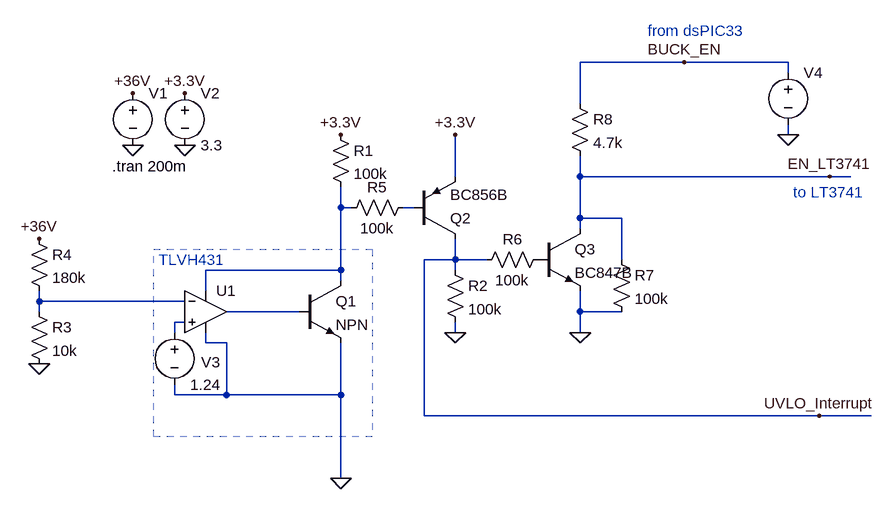
[diagram p0: schematic uvlo.asc]
uvlo.asc, the LTspice schematic file:
Version 4
SHEET 1 1320 680
WIRE 704 -112 544 -112
WIRE 864 -112 704 -112
WIRE 864 -96 864 -112
WIRE 544 -48 544 -112
WIRE 864 0 864 -16
WIRE 352 64 352 0
WIRE 544 64 544 32
WIRE 928 64 544 64
WIRE 960 64 928 64
WIRE 176 112 176 80
WIRE 192 112 176 112
WIRE 288 112 272 112
WIRE 544 128 544 64
WIRE 608 128 544 128
WIRE 544 144 544 128
WIRE 352 192 352 160
WIRE 352 192 304 192
WIRE 400 192 352 192
WIRE 608 192 608 128
WIRE 176 208 176 112
WIRE 176 208 -32 208
WIRE 352 208 352 192
WIRE 176 224 176 208
WIRE -32 240 -32 208
WIRE -288 256 -288 240
WIRE -64 256 -288 256
WIRE -288 272 -288 256
WIRE 112 272 0 272
WIRE 544 272 544 240
WIRE 608 272 544 272
WIRE -64 288 -80 288
WIRE -80 304 -80 288
WIRE 352 304 352 288
WIRE 544 304 544 272
WIRE -32 320 -32 304
WIRE 0 320 -32 320
WIRE -80 400 -80 384
WIRE 0 400 0 320
WIRE 0 400 -80 400
WIRE 176 400 176 320
WIRE 176 400 0 400
WIRE 304 432 304 192
WIRE 912 432 304 432
WIRE 992 432 912 432
WIRE 176 528 176 400
FLAG -144 16 0
FLAG -64 16 0
FLAG -144 -64 +36V
FLAG -64 -64 +3.3V
FLAG -288 352 0
FLAG -288 160 +36V
FLAG 176 528 0
FLAG 928 64 EN_LT3741
FLAG 176 0 +3.3V
FLAG 352 0 +3.3V
FLAG 352 304 0
FLAG 544 304 0
FLAG 864 0 0
FLAG 704 -112 BUCK_EN
FLAG 912 432 UVLO_Interrupt
SYMBOL voltage -144 -80 R0
WINDOW 3 24 96 Invisible 2
WINDOW 123 0 0 Left 2
WINDOW 39 0 0 Left 2
SYMATTR Value PULSE(36 0 0 100m)
SYMATTR InstName V1
SYMBOL voltage -64 -80 R0
WINDOW 123 0 0 Left 2
WINDOW 39 0 0 Left 2
SYMATTR InstName V2
SYMATTR Value 3.3
SYMBOL Opamps\\UniversalOpamp2 -32 272 R0
SYMATTR InstName U1
SYMBOL npn 112 224 R0
SYMATTR InstName Q1
SYMBOL voltage -80 288 R0
WINDOW 0 41 62 Left 2
WINDOW 123 0 0 Left 2
WINDOW 39 0 0 Left 2
SYMATTR InstName V3
SYMATTR Value 1.24
SYMBOL res -304 256 R0
SYMATTR InstName R3
SYMATTR Value 10k
SYMBOL res -304 144 R0
SYMATTR InstName R4
SYMATTR Value 180k
SYMBOL res 160 -16 R0
SYMATTR InstName R1
SYMATTR Value 100k
SYMBOL pnp 288 160 M180
SYMATTR InstName Q2
SYMATTR Value BC856B
SYMBOL res 336 192 R0
SYMATTR InstName R2
SYMATTR Value 100k
SYMBOL res 288 96 R90
WINDOW 0 0 56 VBottom 2
WINDOW 3 32 56 VTop 2
SYMATTR InstName R5
SYMATTR Value 100k
SYMBOL res 496 176 R90
WINDOW 0 0 56 VBottom 2
WINDOW 3 32 56 VTop 2
SYMATTR InstName R6
SYMATTR Value 100k
SYMBOL npn 480 144 R0
SYMATTR InstName Q3
SYMATTR Value BC847B
SYMBOL res 592 176 R0
SYMATTR InstName R7
SYMATTR Value 100k
SYMBOL res 528 -64 R0
SYMATTR InstName R8
SYMATTR Value 4.7k
SYMBOL voltage 864 -112 R0
WINDOW 123 0 0 Left 2
WINDOW 39 0 0 Left 2
WINDOW 3 24 96 Invisible 2
SYMATTR InstName V4
SYMATTR Value PULSE(0 3.3 25m 2n 2n 25m 50m)
TEXT -176 48 Left 2 !.tran 200m
TEXT 648 -160 Left 2 ;from dsPIC33
TEXT 872 88 Left 2 ;to LT3741
TEXT -104 192 Left 2 ;TLVH431
RECTANGLE Normal 224 464 -112 176 2

The netlist it stands for:
* uvlo.asc
V1 +36V 0 PULSE(36 0 0 100m)
V2 +3.3V 0 3.3
XU1 N005 N003 N001 0 N004 level.2 Avol=1Meg GBW=10Meg Slew=10Meg ilimit=25m rail=0 Vos=0 phimargin=45 en=0 enk=0 in=0 ink=0 Rin=500Meg  ; pins IN+ IN- V+ V- OUT
Q1 N001 N004 0 0 NPN
V3 N005 0 1.24
R3 N003 0 10k
R4 +36V N003 180k
R1 +3.3V N001 100k
Q2 UVLO_Interrupt N002 +3.3V 0 BC856B
R2 UVLO_Interrupt 0 100k
R5 N002 N001 100k
R6 P001 UVLO_Interrupt 100k
Q3 EN_LT3741 P001 0 0 BC847B
R7 EN_LT3741 0 100k
R8 BUCK_EN EN_LT3741 4.7k
V4 BUCK_EN 0 PULSE(0 3.3 25m 2n 2n 25m 50m)
.model NPN NPN
.model PNP PNP
.lib standard.bjt
.tran 200m
* from dsPIC33
* to LT3741
* TLVH431
.lib UniversalOpamps2.sub
.backanno
.end